# EAGLE schematic gmatrix (EAGLE 9.6.0)
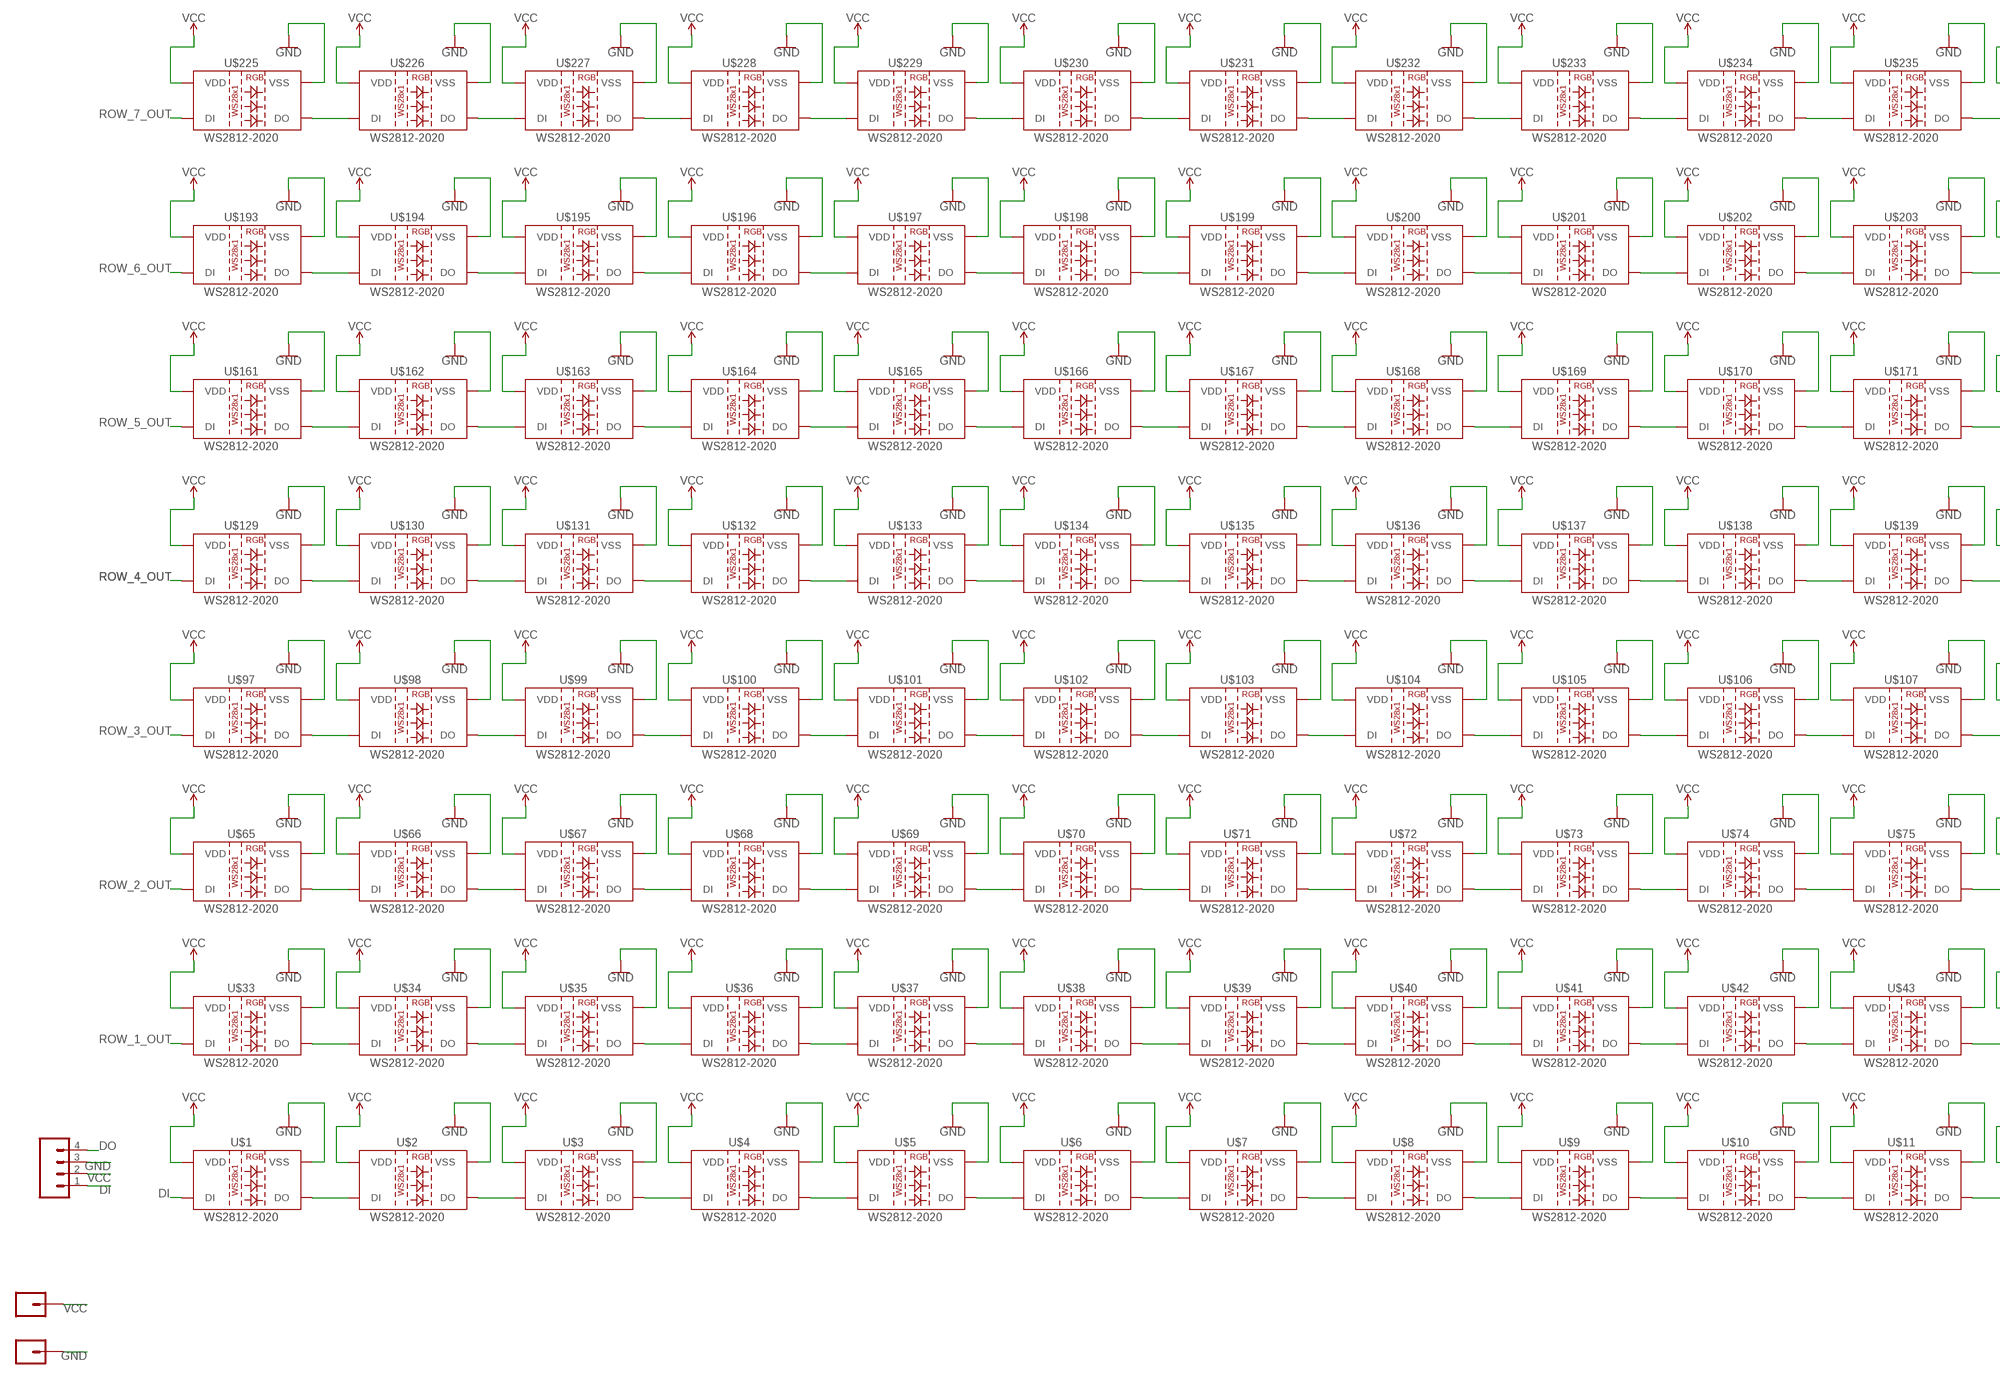
[diagram p0: schematic, sheet 1, part 1 of 3]
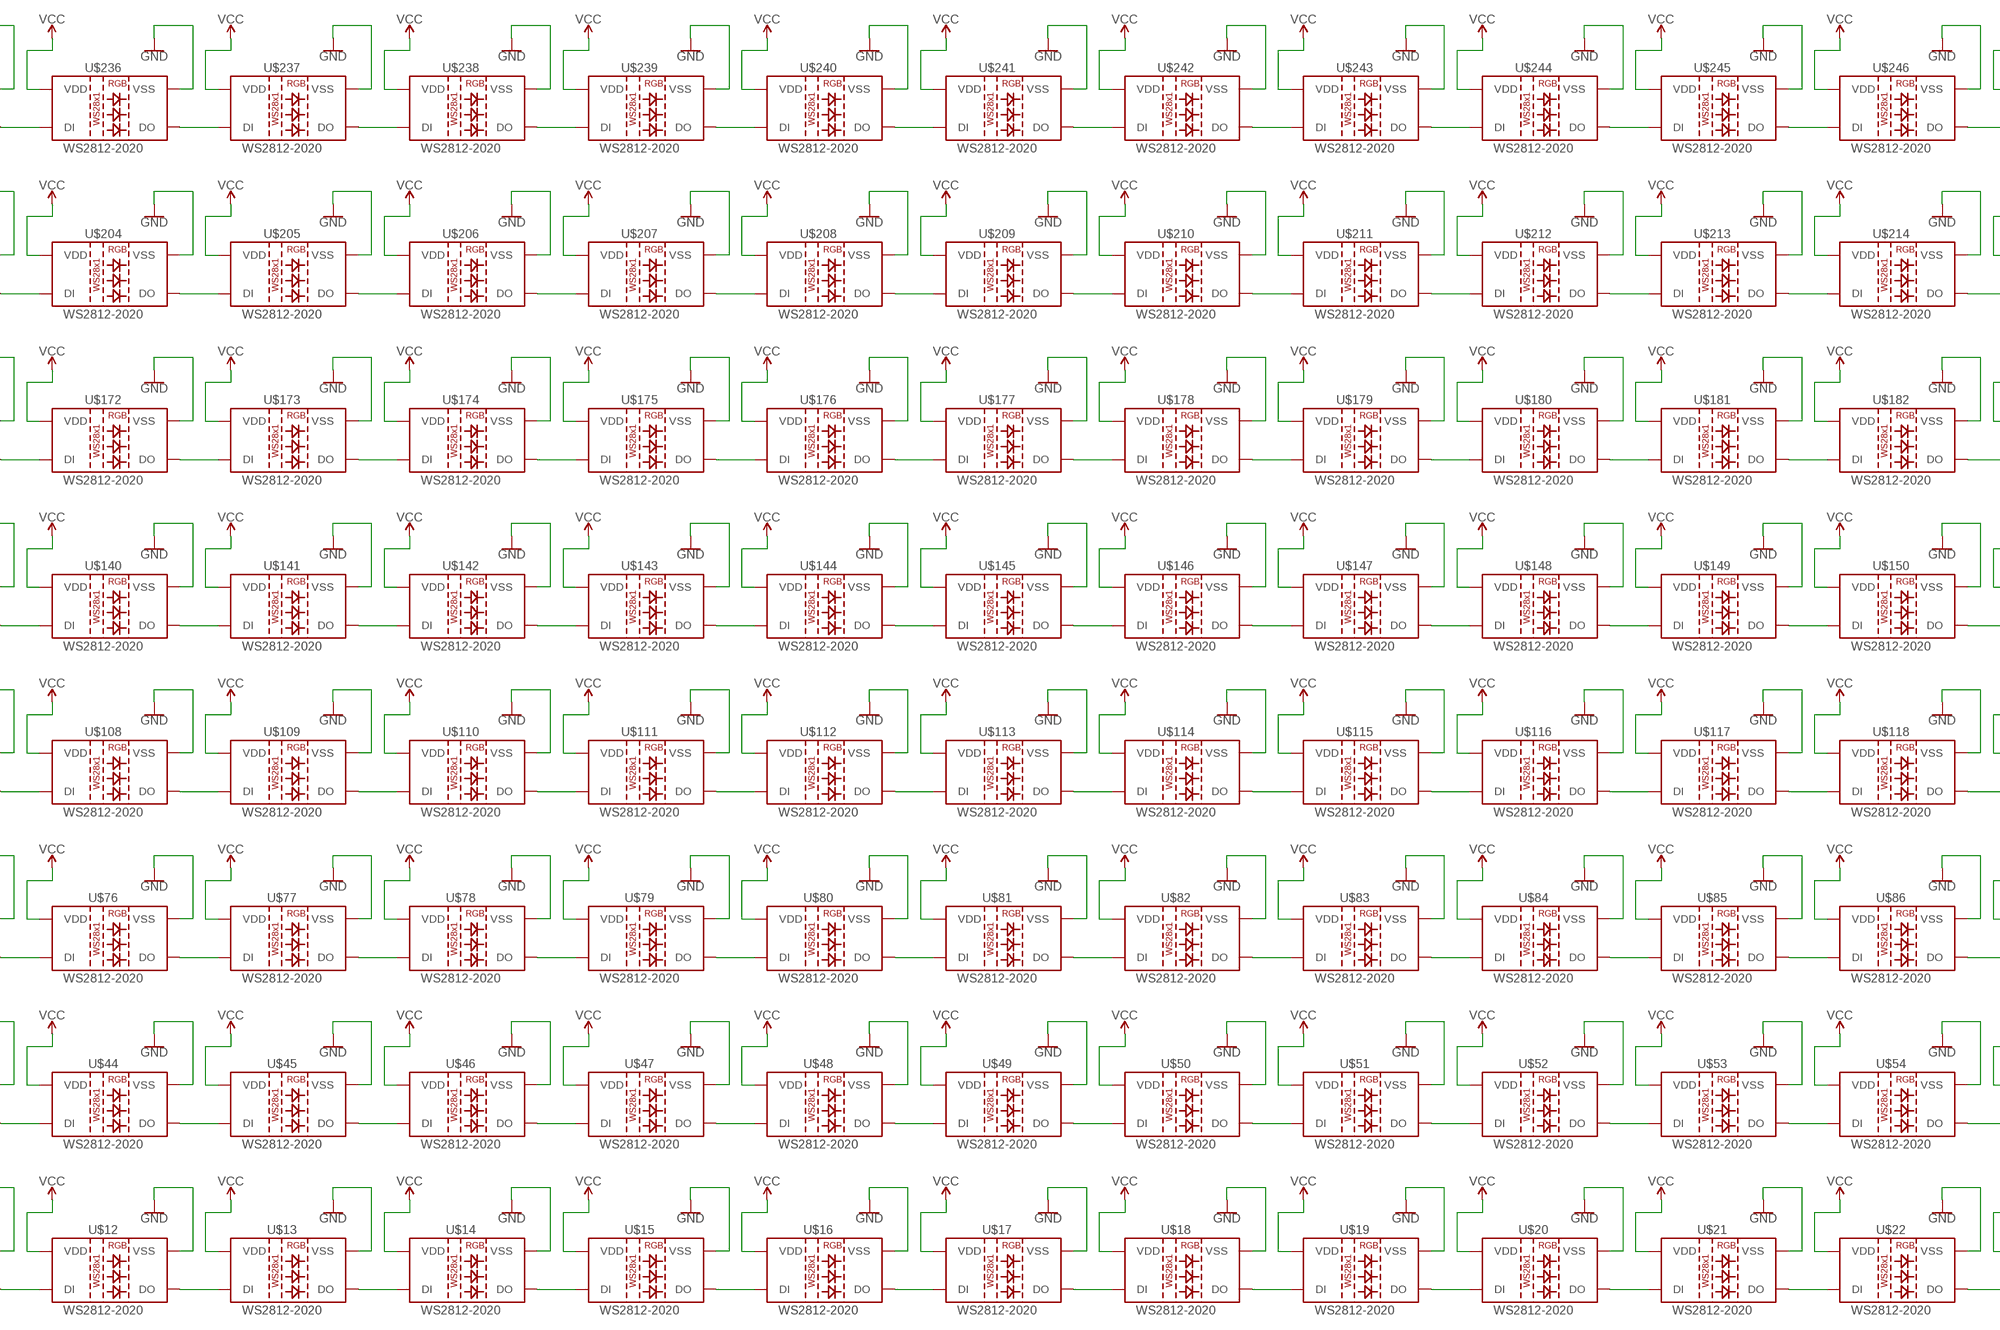
[diagram p1: schematic, sheet 1, part 2 of 3]
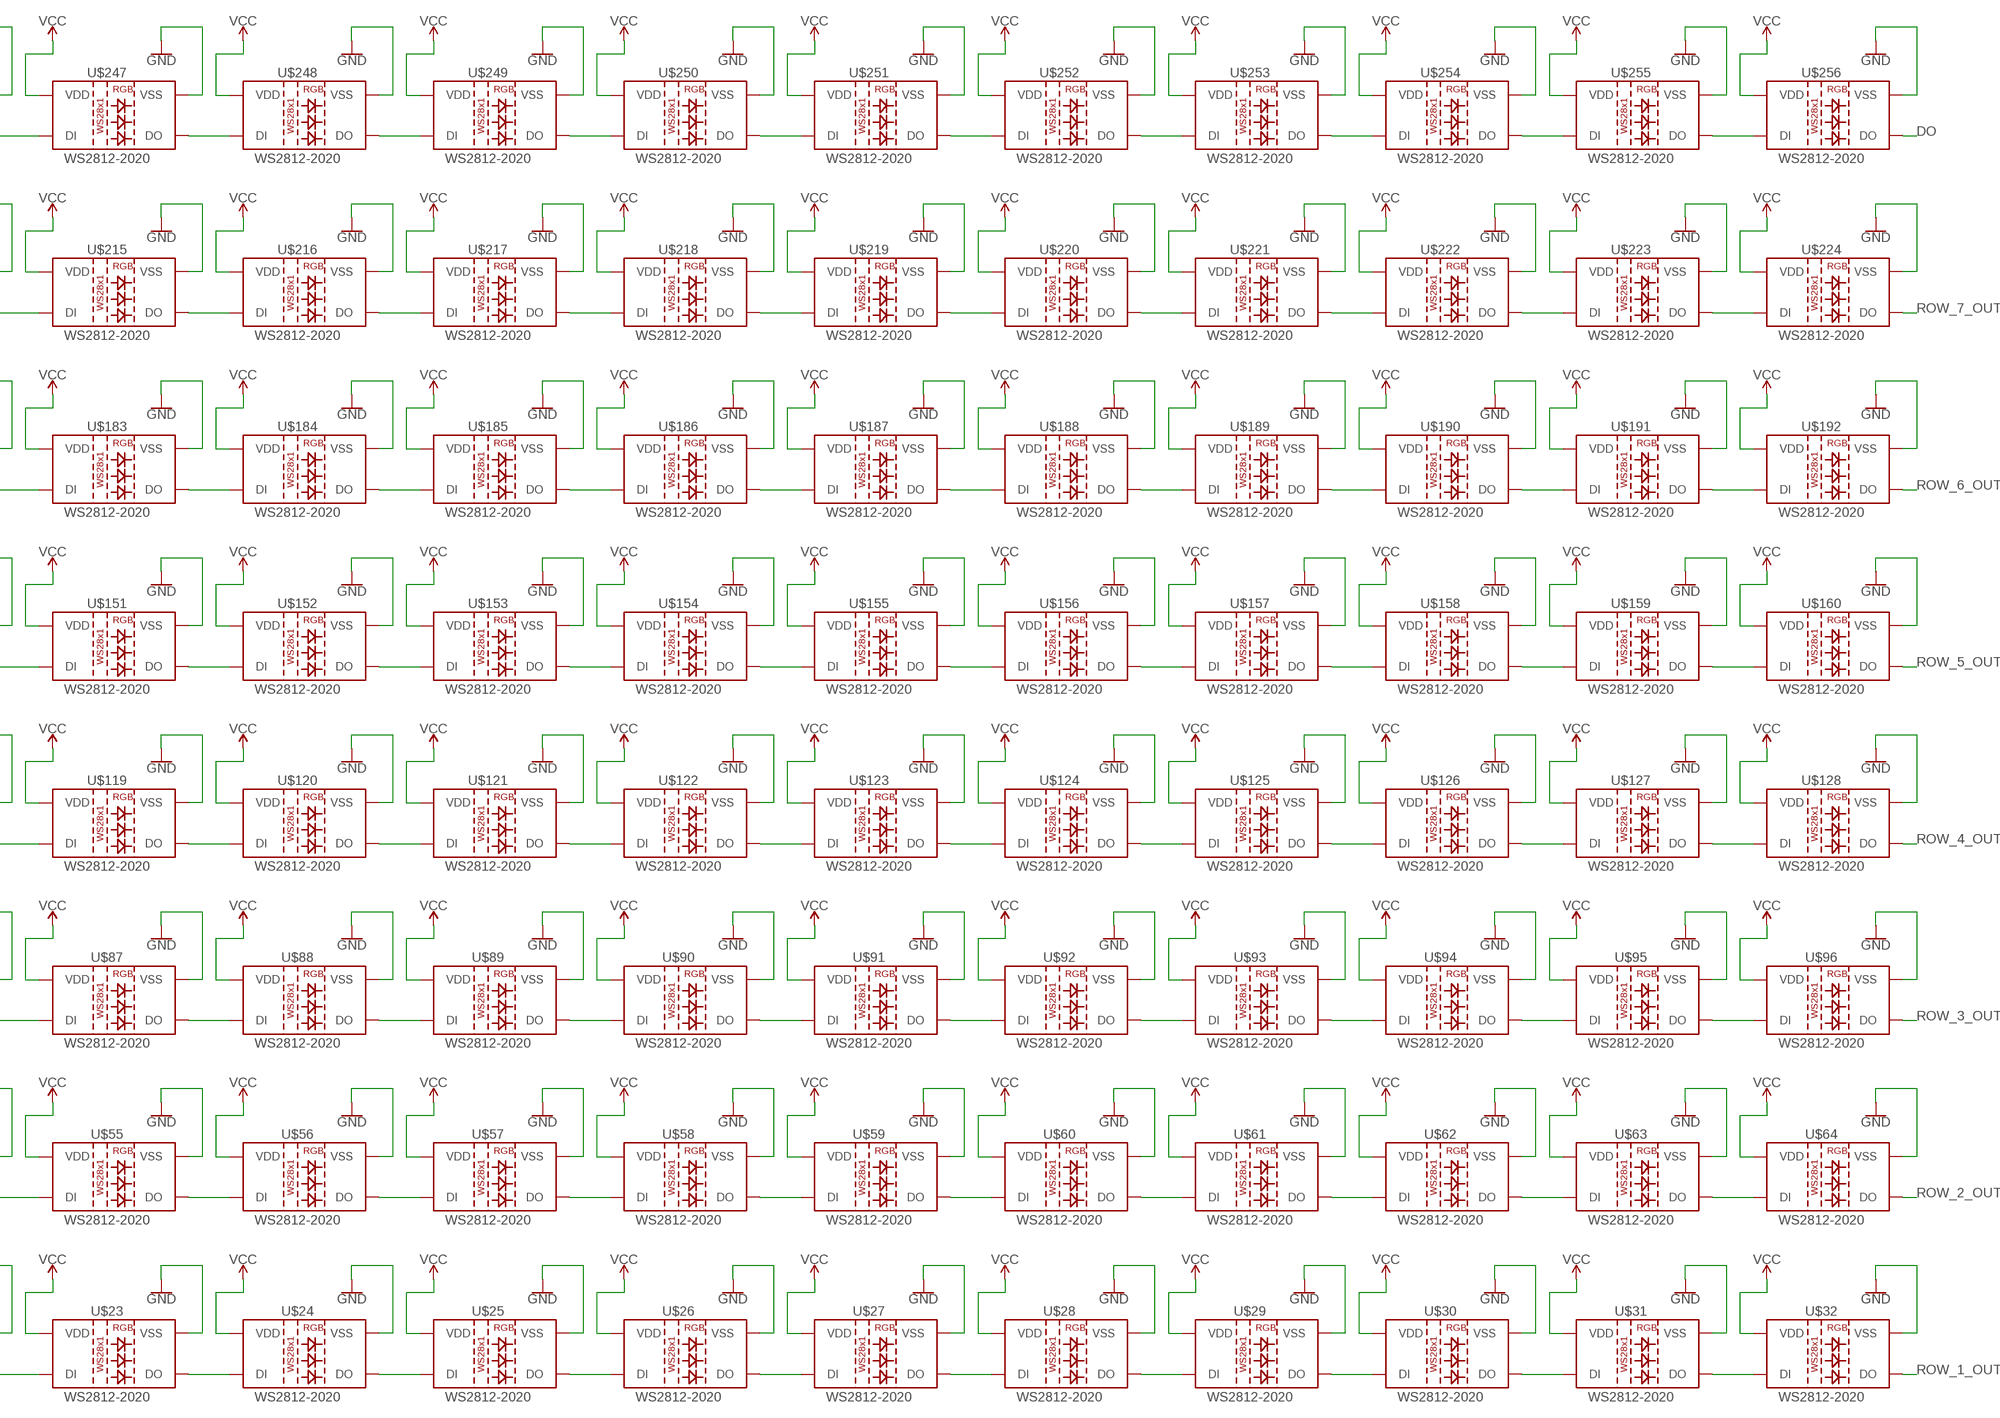
[diagram p2: schematic, sheet 1, part 3 of 3]

## Parts
J1  CONN_041X04_NO_SILK  [1X04_NO_SILK]
J2  CONN_01PTH_NO_SILK_KIT  [1X01NS_KIT]
J3  CONN_01PTH_NO_SILK_KIT  [1X01NS_KIT]
U$1  WS2812-2020  [WS2812-2020]
U$2  WS2812-2020  [WS2812-2020]
U$3  WS2812-2020  [WS2812-2020]
U$4  WS2812-2020  [WS2812-2020]
U$5  WS2812-2020  [WS2812-2020]
U$6  WS2812-2020  [WS2812-2020]
U$7  WS2812-2020  [WS2812-2020]
U$8  WS2812-2020  [WS2812-2020]
U$9  WS2812-2020  [WS2812-2020]
U$10  WS2812-2020  [WS2812-2020]
U$11  WS2812-2020  [WS2812-2020]
U$12  WS2812-2020  [WS2812-2020]
U$13  WS2812-2020  [WS2812-2020]
U$14  WS2812-2020  [WS2812-2020]
U$15  WS2812-2020  [WS2812-2020]
U$16  WS2812-2020  [WS2812-2020]
U$17  WS2812-2020  [WS2812-2020]
U$18  WS2812-2020  [WS2812-2020]
U$19  WS2812-2020  [WS2812-2020]
U$20  WS2812-2020  [WS2812-2020]
U$21  WS2812-2020  [WS2812-2020]
U$22  WS2812-2020  [WS2812-2020]
U$23  WS2812-2020  [WS2812-2020]
U$24  WS2812-2020  [WS2812-2020]
U$25  WS2812-2020  [WS2812-2020]
U$26  WS2812-2020  [WS2812-2020]
U$27  WS2812-2020  [WS2812-2020]
U$28  WS2812-2020  [WS2812-2020]
U$29  WS2812-2020  [WS2812-2020]
U$30  WS2812-2020  [WS2812-2020]
U$31  WS2812-2020  [WS2812-2020]
U$32  WS2812-2020  [WS2812-2020]
U$33  WS2812-2020  [WS2812-2020]
U$34  WS2812-2020  [WS2812-2020]
U$35  WS2812-2020  [WS2812-2020]
U$36  WS2812-2020  [WS2812-2020]
U$37  WS2812-2020  [WS2812-2020]
U$38  WS2812-2020  [WS2812-2020]
U$39  WS2812-2020  [WS2812-2020]
U$40  WS2812-2020  [WS2812-2020]
U$41  WS2812-2020  [WS2812-2020]
U$42  WS2812-2020  [WS2812-2020]
U$43  WS2812-2020  [WS2812-2020]
U$44  WS2812-2020  [WS2812-2020]
U$45  WS2812-2020  [WS2812-2020]
U$46  WS2812-2020  [WS2812-2020]
U$47  WS2812-2020  [WS2812-2020]
U$48  WS2812-2020  [WS2812-2020]
U$49  WS2812-2020  [WS2812-2020]
U$50  WS2812-2020  [WS2812-2020]
U$51  WS2812-2020  [WS2812-2020]
U$52  WS2812-2020  [WS2812-2020]
U$53  WS2812-2020  [WS2812-2020]
U$54  WS2812-2020  [WS2812-2020]
U$55  WS2812-2020  [WS2812-2020]
U$56  WS2812-2020  [WS2812-2020]
U$57  WS2812-2020  [WS2812-2020]
U$58  WS2812-2020  [WS2812-2020]
U$59  WS2812-2020  [WS2812-2020]
U$60  WS2812-2020  [WS2812-2020]
U$61  WS2812-2020  [WS2812-2020]
U$62  WS2812-2020  [WS2812-2020]
U$63  WS2812-2020  [WS2812-2020]
U$64  WS2812-2020  [WS2812-2020]
U$65  WS2812-2020  [WS2812-2020]
U$66  WS2812-2020  [WS2812-2020]
U$67  WS2812-2020  [WS2812-2020]
U$68  WS2812-2020  [WS2812-2020]
U$69  WS2812-2020  [WS2812-2020]
U$70  WS2812-2020  [WS2812-2020]
U$71  WS2812-2020  [WS2812-2020]
U$72  WS2812-2020  [WS2812-2020]
U$73  WS2812-2020  [WS2812-2020]
U$74  WS2812-2020  [WS2812-2020]
U$75  WS2812-2020  [WS2812-2020]
U$76  WS2812-2020  [WS2812-2020]
U$77  WS2812-2020  [WS2812-2020]
U$78  WS2812-2020  [WS2812-2020]
U$79  WS2812-2020  [WS2812-2020]
U$80  WS2812-2020  [WS2812-2020]
U$81  WS2812-2020  [WS2812-2020]
U$82  WS2812-2020  [WS2812-2020]
U$83  WS2812-2020  [WS2812-2020]
U$84  WS2812-2020  [WS2812-2020]
U$85  WS2812-2020  [WS2812-2020]
U$86  WS2812-2020  [WS2812-2020]
U$87  WS2812-2020  [WS2812-2020]
U$88  WS2812-2020  [WS2812-2020]
U$89  WS2812-2020  [WS2812-2020]
U$90  WS2812-2020  [WS2812-2020]
U$91  WS2812-2020  [WS2812-2020]
U$92  WS2812-2020  [WS2812-2020]
U$93  WS2812-2020  [WS2812-2020]
U$94  WS2812-2020  [WS2812-2020]
U$95  WS2812-2020  [WS2812-2020]
U$96  WS2812-2020  [WS2812-2020]
U$97  WS2812-2020  [WS2812-2020]
U$98  WS2812-2020  [WS2812-2020]
U$99  WS2812-2020  [WS2812-2020]
U$100  WS2812-2020  [WS2812-2020]
U$101  WS2812-2020  [WS2812-2020]
U$102  WS2812-2020  [WS2812-2020]
U$103  WS2812-2020  [WS2812-2020]
U$104  WS2812-2020  [WS2812-2020]
U$105  WS2812-2020  [WS2812-2020]
U$106  WS2812-2020  [WS2812-2020]
U$107  WS2812-2020  [WS2812-2020]
U$108  WS2812-2020  [WS2812-2020]
U$109  WS2812-2020  [WS2812-2020]
U$110  WS2812-2020  [WS2812-2020]
U$111  WS2812-2020  [WS2812-2020]
U$112  WS2812-2020  [WS2812-2020]
U$113  WS2812-2020  [WS2812-2020]
U$114  WS2812-2020  [WS2812-2020]
U$115  WS2812-2020  [WS2812-2020]
U$116  WS2812-2020  [WS2812-2020]
U$117  WS2812-2020  [WS2812-2020]
U$118  WS2812-2020  [WS2812-2020]
U$119  WS2812-2020  [WS2812-2020]
U$120  WS2812-2020  [WS2812-2020]
U$121  WS2812-2020  [WS2812-2020]
U$122  WS2812-2020  [WS2812-2020]
U$123  WS2812-2020  [WS2812-2020]
U$124  WS2812-2020  [WS2812-2020]
U$125  WS2812-2020  [WS2812-2020]
U$126  WS2812-2020  [WS2812-2020]
U$127  WS2812-2020  [WS2812-2020]
U$128  WS2812-2020  [WS2812-2020]
U$129  WS2812-2020  [WS2812-2020]
U$130  WS2812-2020  [WS2812-2020]
U$131  WS2812-2020  [WS2812-2020]
U$132  WS2812-2020  [WS2812-2020]
U$133  WS2812-2020  [WS2812-2020]
U$134  WS2812-2020  [WS2812-2020]
U$135  WS2812-2020  [WS2812-2020]
U$136  WS2812-2020  [WS2812-2020]
U$137  WS2812-2020  [WS2812-2020]
U$138  WS2812-2020  [WS2812-2020]
U$139  WS2812-2020  [WS2812-2020]
U$140  WS2812-2020  [WS2812-2020]
U$141  WS2812-2020  [WS2812-2020]
U$142  WS2812-2020  [WS2812-2020]
U$143  WS2812-2020  [WS2812-2020]
U$144  WS2812-2020  [WS2812-2020]
U$145  WS2812-2020  [WS2812-2020]
U$146  WS2812-2020  [WS2812-2020]
U$147  WS2812-2020  [WS2812-2020]
U$148  WS2812-2020  [WS2812-2020]
U$149  WS2812-2020  [WS2812-2020]
U$150  WS2812-2020  [WS2812-2020]
U$151  WS2812-2020  [WS2812-2020]
U$152  WS2812-2020  [WS2812-2020]
U$153  WS2812-2020  [WS2812-2020]
U$154  WS2812-2020  [WS2812-2020]
U$155  WS2812-2020  [WS2812-2020]
U$156  WS2812-2020  [WS2812-2020]
U$157  WS2812-2020  [WS2812-2020]
U$158  WS2812-2020  [WS2812-2020]
U$159  WS2812-2020  [WS2812-2020]
U$160  WS2812-2020  [WS2812-2020]
U$161  WS2812-2020  [WS2812-2020]
U$162  WS2812-2020  [WS2812-2020]
U$163  WS2812-2020  [WS2812-2020]
U$164  WS2812-2020  [WS2812-2020]
U$165  WS2812-2020  [WS2812-2020]
U$166  WS2812-2020  [WS2812-2020]
U$167  WS2812-2020  [WS2812-2020]
U$168  WS2812-2020  [WS2812-2020]
U$169  WS2812-2020  [WS2812-2020]
U$170  WS2812-2020  [WS2812-2020]
U$171  WS2812-2020  [WS2812-2020]
U$172  WS2812-2020  [WS2812-2020]
U$173  WS2812-2020  [WS2812-2020]
U$174  WS2812-2020  [WS2812-2020]
U$175  WS2812-2020  [WS2812-2020]
U$176  WS2812-2020  [WS2812-2020]
U$177  WS2812-2020  [WS2812-2020]
U$178  WS2812-2020  [WS2812-2020]
U$179  WS2812-2020  [WS2812-2020]
U$180  WS2812-2020  [WS2812-2020]
U$181  WS2812-2020  [WS2812-2020]
U$182  WS2812-2020  [WS2812-2020]
U$183  WS2812-2020  [WS2812-2020]
U$184  WS2812-2020  [WS2812-2020]
U$185  WS2812-2020  [WS2812-2020]
U$186  WS2812-2020  [WS2812-2020]
U$187  WS2812-2020  [WS2812-2020]
U$188  WS2812-2020  [WS2812-2020]
U$189  WS2812-2020  [WS2812-2020]
U$190  WS2812-2020  [WS2812-2020]
U$191  WS2812-2020  [WS2812-2020]
U$192  WS2812-2020  [WS2812-2020]
U$193  WS2812-2020  [WS2812-2020]
U$194  WS2812-2020  [WS2812-2020]
U$195  WS2812-2020  [WS2812-2020]
U$196  WS2812-2020  [WS2812-2020]
U$197  WS2812-2020  [WS2812-2020]
U$198  WS2812-2020  [WS2812-2020]
U$199  WS2812-2020  [WS2812-2020]
U$200  WS2812-2020  [WS2812-2020]
U$201  WS2812-2020  [WS2812-2020]
U$202  WS2812-2020  [WS2812-2020]
U$203  WS2812-2020  [WS2812-2020]
U$204  WS2812-2020  [WS2812-2020]
U$205  WS2812-2020  [WS2812-2020]
U$206  WS2812-2020  [WS2812-2020]
U$207  WS2812-2020  [WS2812-2020]
U$208  WS2812-2020  [WS2812-2020]
U$209  WS2812-2020  [WS2812-2020]
U$210  WS2812-2020  [WS2812-2020]
U$211  WS2812-2020  [WS2812-2020]
U$212  WS2812-2020  [WS2812-2020]
U$213  WS2812-2020  [WS2812-2020]
U$214  WS2812-2020  [WS2812-2020]
U$215  WS2812-2020  [WS2812-2020]
U$216  WS2812-2020  [WS2812-2020]
U$217  WS2812-2020  [WS2812-2020]
U$218  WS2812-2020  [WS2812-2020]
U$219  WS2812-2020  [WS2812-2020]
U$220  WS2812-2020  [WS2812-2020]
U$221  WS2812-2020  [WS2812-2020]
U$222  WS2812-2020  [WS2812-2020]
U$223  WS2812-2020  [WS2812-2020]
U$224  WS2812-2020  [WS2812-2020]
U$225  WS2812-2020  [WS2812-2020]
U$226  WS2812-2020  [WS2812-2020]
U$227  WS2812-2020  [WS2812-2020]
U$228  WS2812-2020  [WS2812-2020]
U$229  WS2812-2020  [WS2812-2020]
U$230  WS2812-2020  [WS2812-2020]
U$231  WS2812-2020  [WS2812-2020]
U$232  WS2812-2020  [WS2812-2020]
U$233  WS2812-2020  [WS2812-2020]
U$234  WS2812-2020  [WS2812-2020]
U$235  WS2812-2020  [WS2812-2020]
U$236  WS2812-2020  [WS2812-2020]
U$237  WS2812-2020  [WS2812-2020]
U$238  WS2812-2020  [WS2812-2020]
U$239  WS2812-2020  [WS2812-2020]
U$240  WS2812-2020  [WS2812-2020]
U$241  WS2812-2020  [WS2812-2020]
U$242  WS2812-2020  [WS2812-2020]
U$243  WS2812-2020  [WS2812-2020]
U$244  WS2812-2020  [WS2812-2020]
U$245  WS2812-2020  [WS2812-2020]
U$246  WS2812-2020  [WS2812-2020]
U$247  WS2812-2020  [WS2812-2020]
U$248  WS2812-2020  [WS2812-2020]
U$249  WS2812-2020  [WS2812-2020]
U$250  WS2812-2020  [WS2812-2020]
U$251  WS2812-2020  [WS2812-2020]
U$252  WS2812-2020  [WS2812-2020]
U$253  WS2812-2020  [WS2812-2020]
U$254  WS2812-2020  [WS2812-2020]
U$255  WS2812-2020  [WS2812-2020]
U$256  WS2812-2020  [WS2812-2020]

## Nets
DI: J1.1 U$1.3(DI)
DO: J1.4 U$256.1(DO)
GND: J1.3 J3.1 U$1.2(VSS) U$2.2(VSS) U$3.2(VSS) U$4.2(VSS) U$5.2(VSS) U$6.2(VSS) U$7.2(VSS) U$8.2(VSS) U$9.2(VSS) U$10.2(VSS) U$11.2(VSS) U$12.2(VSS) U$13.2(VSS) U$14.2(VSS) U$15.2(VSS) U$16.2(VSS) U$17.2(VSS) U$18.2(VSS) U$19.2(VSS) U$20.2(VSS) U$21.2(VSS) U$22.2(VSS) U$23.2(VSS) U$24.2(VSS) U$25.2(VSS) U$26.2(VSS) U$27.2(VSS) U$28.2(VSS) U$29.2(VSS) U$30.2(VSS) U$31.2(VSS) U$32.2(VSS) U$33.2(VSS) U$34.2(VSS) U$35.2(VSS) U$36.2(VSS) U$37.2(VSS) U$38.2(VSS) U$39.2(VSS) U$40.2(VSS) U$41.2(VSS) U$42.2(VSS) U$43.2(VSS) U$44.2(VSS) U$45.2(VSS) U$46.2(VSS) U$47.2(VSS) U$48.2(VSS) U$49.2(VSS) U$50.2(VSS) U$51.2(VSS) U$52.2(VSS) U$53.2(VSS) U$54.2(VSS) U$55.2(VSS) U$56.2(VSS) U$57.2(VSS) U$58.2(VSS) U$59.2(VSS) U$60.2(VSS) U$61.2(VSS) U$62.2(VSS) U$63.2(VSS) U$64.2(VSS) U$65.2(VSS) U$66.2(VSS) U$67.2(VSS) U$68.2(VSS) U$69.2(VSS) U$70.2(VSS) U$71.2(VSS) U$72.2(VSS) U$73.2(VSS) U$74.2(VSS) U$75.2(VSS) U$76.2(VSS) U$77.2(VSS) U$78.2(VSS) U$79.2(VSS) U$80.2(VSS) U$81.2(VSS) U$82.2(VSS) U$83.2(VSS) U$84.2(VSS) U$85.2(VSS) U$86.2(VSS) U$87.2(VSS) U$88.2(VSS) U$89.2(VSS) U$90.2(VSS) U$91.2(VSS) U$92.2(VSS) U$93.2(VSS) U$94.2(VSS) U$95.2(VSS) U$96.2(VSS) U$97.2(VSS) U$98.2(VSS) U$99.2(VSS) U$100.2(VSS) U$101.2(VSS) U$102.2(VSS) U$103.2(VSS) U$104.2(VSS) U$105.2(VSS) U$106.2(VSS) U$107.2(VSS) U$108.2(VSS) U$109.2(VSS) U$110.2(VSS) U$111.2(VSS) U$112.2(VSS) U$113.2(VSS) U$114.2(VSS) U$115.2(VSS) U$116.2(VSS) U$117.2(VSS) U$118.2(VSS) U$119.2(VSS) U$120.2(VSS) U$121.2(VSS) U$122.2(VSS) U$123.2(VSS) U$124.2(VSS) U$125.2(VSS) U$126.2(VSS) U$127.2(VSS) U$128.2(VSS) U$129.2(VSS) U$130.2(VSS) U$131.2(VSS) U$132.2(VSS) U$133.2(VSS) U$134.2(VSS) U$135.2(VSS) U$136.2(VSS) U$137.2(VSS) U$138.2(VSS) U$139.2(VSS) U$140.2(VSS) U$141.2(VSS) U$142.2(VSS) U$143.2(VSS) U$144.2(VSS) U$145.2(VSS) U$146.2(VSS) U$147.2(VSS) U$148.2(VSS) U$149.2(VSS) U$150.2(VSS) U$151.2(VSS) U$152.2(VSS) U$153.2(VSS) U$154.2(VSS) U$155.2(VSS) U$156.2(VSS) U$157.2(VSS) U$158.2(VSS) U$159.2(VSS) U$160.2(VSS) U$161.2(VSS) U$162.2(VSS) U$163.2(VSS) U$164.2(VSS) U$165.2(VSS) U$166.2(VSS) U$167.2(VSS) U$168.2(VSS) U$169.2(VSS) U$170.2(VSS) U$171.2(VSS) U$172.2(VSS) U$173.2(VSS) U$174.2(VSS) U$175.2(VSS) U$176.2(VSS) U$177.2(VSS) U$178.2(VSS) U$179.2(VSS) U$180.2(VSS) U$181.2(VSS) U$182.2(VSS) U$183.2(VSS) U$184.2(VSS) U$185.2(VSS) U$186.2(VSS) U$187.2(VSS) U$188.2(VSS) U$189.2(VSS) U$190.2(VSS) U$191.2(VSS) U$192.2(VSS) U$193.2(VSS) U$194.2(VSS) U$195.2(VSS) U$196.2(VSS) U$197.2(VSS) U$198.2(VSS) U$199.2(VSS) U$200.2(VSS) U$201.2(VSS) U$202.2(VSS) U$203.2(VSS) U$204.2(VSS) U$205.2(VSS) U$206.2(VSS) U$207.2(VSS) U$208.2(VSS) U$209.2(VSS) U$210.2(VSS) U$211.2(VSS) U$212.2(VSS) U$213.2(VSS) U$214.2(VSS) U$215.2(VSS) U$216.2(VSS) U$217.2(VSS) U$218.2(VSS) U$219.2(VSS) U$220.2(VSS) U$221.2(VSS) U$222.2(VSS) U$223.2(VSS) U$224.2(VSS) U$225.2(VSS) U$226.2(VSS) U$227.2(VSS) U$228.2(VSS) U$229.2(VSS) U$230.2(VSS) U$231.2(VSS) U$232.2(VSS) U$233.2(VSS) U$234.2(VSS) U$235.2(VSS) U$236.2(VSS) U$237.2(VSS) U$238.2(VSS) U$239.2(VSS) U$240.2(VSS) U$241.2(VSS) U$242.2(VSS) U$243.2(VSS) U$244.2(VSS) U$245.2(VSS) U$246.2(VSS) U$247.2(VSS) U$248.2(VSS) U$249.2(VSS) U$250.2(VSS) U$251.2(VSS) U$252.2(VSS) U$253.2(VSS) U$254.2(VSS) U$255.2(VSS) U$256.2(VSS)
N$1: U$1.1(DO) U$2.3(DI)
N$2: U$2.1(DO) U$3.3(DI)
N$3: U$3.1(DO) U$4.3(DI)
N$4: U$4.1(DO) U$5.3(DI)
N$5: U$5.1(DO) U$6.3(DI)
N$6: U$6.1(DO) U$7.3(DI)
N$7: U$7.1(DO) U$8.3(DI)
N$8: U$8.1(DO) U$9.3(DI)
N$9: U$9.1(DO) U$10.3(DI)
N$10: U$10.1(DO) U$11.3(DI)
N$11: U$11.1(DO) U$12.3(DI)
N$12: U$12.1(DO) U$13.3(DI)
N$13: U$13.1(DO) U$14.3(DI)
N$14: U$14.1(DO) U$15.3(DI)
N$15: U$15.1(DO) U$16.3(DI)
N$16: U$16.1(DO) U$17.3(DI)
N$17: U$17.1(DO) U$18.3(DI)
N$18: U$18.1(DO) U$19.3(DI)
N$19: U$19.1(DO) U$20.3(DI)
N$20: U$20.1(DO) U$21.3(DI)
N$21: U$21.1(DO) U$22.3(DI)
N$22: U$22.1(DO) U$23.3(DI)
N$23: U$23.1(DO) U$24.3(DI)
N$24: U$24.1(DO) U$25.3(DI)
N$25: U$25.1(DO) U$26.3(DI)
N$26: U$26.1(DO) U$27.3(DI)
N$27: U$27.1(DO) U$28.3(DI)
N$28: U$28.1(DO) U$29.3(DI)
N$29: U$29.1(DO) U$30.3(DI)
N$30: U$30.1(DO) U$31.3(DI)
N$31: U$31.1(DO) U$32.3(DI)
N$32: U$33.1(DO) U$34.3(DI)
N$33: U$34.1(DO) U$35.3(DI)
N$34: U$35.1(DO) U$36.3(DI)
N$35: U$36.1(DO) U$37.3(DI)
N$36: U$37.1(DO) U$38.3(DI)
N$37: U$38.1(DO) U$39.3(DI)
N$38: U$39.1(DO) U$40.3(DI)
N$39: U$40.1(DO) U$41.3(DI)
N$40: U$41.1(DO) U$42.3(DI)
N$41: U$42.1(DO) U$43.3(DI)
N$42: U$43.1(DO) U$44.3(DI)
N$43: U$44.1(DO) U$45.3(DI)
N$44: U$45.1(DO) U$46.3(DI)
N$45: U$46.1(DO) U$47.3(DI)
N$46: U$47.1(DO) U$48.3(DI)
N$47: U$48.1(DO) U$49.3(DI)
N$48: U$49.1(DO) U$50.3(DI)
N$49: U$50.1(DO) U$51.3(DI)
N$50: U$51.1(DO) U$52.3(DI)
N$51: U$52.1(DO) U$53.3(DI)
N$52: U$53.1(DO) U$54.3(DI)
N$53: U$54.1(DO) U$55.3(DI)
N$54: U$55.1(DO) U$56.3(DI)
N$55: U$56.1(DO) U$57.3(DI)
N$56: U$57.1(DO) U$58.3(DI)
N$57: U$58.1(DO) U$59.3(DI)
N$58: U$59.1(DO) U$60.3(DI)
N$59: U$60.1(DO) U$61.3(DI)
N$60: U$61.1(DO) U$62.3(DI)
N$61: U$62.1(DO) U$63.3(DI)
N$62: U$63.1(DO) U$64.3(DI)
N$63: U$65.1(DO) U$66.3(DI)
N$64: U$66.1(DO) U$67.3(DI)
N$65: U$67.1(DO) U$68.3(DI)
N$66: U$68.1(DO) U$69.3(DI)
N$67: U$69.1(DO) U$70.3(DI)
N$68: U$70.1(DO) U$71.3(DI)
N$69: U$71.1(DO) U$72.3(DI)
N$70: U$72.1(DO) U$73.3(DI)
N$71: U$73.1(DO) U$74.3(DI)
N$72: U$74.1(DO) U$75.3(DI)
N$73: U$75.1(DO) U$76.3(DI)
N$74: U$76.1(DO) U$77.3(DI)
N$75: U$77.1(DO) U$78.3(DI)
N$76: U$78.1(DO) U$79.3(DI)
N$77: U$79.1(DO) U$80.3(DI)
N$78: U$80.1(DO) U$81.3(DI)
N$79: U$81.1(DO) U$82.3(DI)
N$80: U$82.1(DO) U$83.3(DI)
N$81: U$83.1(DO) U$84.3(DI)
N$82: U$84.1(DO) U$85.3(DI)
N$83: U$85.1(DO) U$86.3(DI)
N$84: U$86.1(DO) U$87.3(DI)
N$85: U$87.1(DO) U$88.3(DI)
N$86: U$88.1(DO) U$89.3(DI)
N$87: U$89.1(DO) U$90.3(DI)
N$88: U$90.1(DO) U$91.3(DI)
N$89: U$91.1(DO) U$92.3(DI)
N$90: U$92.1(DO) U$93.3(DI)
N$91: U$93.1(DO) U$94.3(DI)
N$92: U$94.1(DO) U$95.3(DI)
N$93: U$95.1(DO) U$96.3(DI)
N$94: U$97.1(DO) U$98.3(DI)
N$95: U$98.1(DO) U$99.3(DI)
N$96: U$99.1(DO) U$100.3(DI)
N$97: U$100.1(DO) U$101.3(DI)
N$98: U$101.1(DO) U$102.3(DI)
N$99: U$102.1(DO) U$103.3(DI)
N$100: U$103.1(DO) U$104.3(DI)
N$101: U$104.1(DO) U$105.3(DI)
N$102: U$105.1(DO) U$106.3(DI)
N$103: U$106.1(DO) U$107.3(DI)
N$104: U$107.1(DO) U$108.3(DI)
N$105: U$108.1(DO) U$109.3(DI)
N$106: U$109.1(DO) U$110.3(DI)
N$107: U$110.1(DO) U$111.3(DI)
N$108: U$111.1(DO) U$112.3(DI)
N$109: U$112.1(DO) U$113.3(DI)
N$110: U$113.1(DO) U$114.3(DI)
N$111: U$114.1(DO) U$115.3(DI)
N$112: U$115.1(DO) U$116.3(DI)
N$113: U$116.1(DO) U$117.3(DI)
N$114: U$117.1(DO) U$118.3(DI)
N$115: U$118.1(DO) U$119.3(DI)
N$116: U$119.1(DO) U$120.3(DI)
N$117: U$120.1(DO) U$121.3(DI)
N$118: U$121.1(DO) U$122.3(DI)
N$119: U$122.1(DO) U$123.3(DI)
N$120: U$123.1(DO) U$124.3(DI)
N$121: U$124.1(DO) U$125.3(DI)
N$122: U$125.1(DO) U$126.3(DI)
N$123: U$126.1(DO) U$127.3(DI)
N$124: U$127.1(DO) U$128.3(DI)
N$125: U$129.1(DO) U$130.3(DI)
N$126: U$130.1(DO) U$131.3(DI)
N$127: U$131.1(DO) U$132.3(DI)
N$128: U$132.1(DO) U$133.3(DI)
N$129: U$133.1(DO) U$134.3(DI)
N$130: U$134.1(DO) U$135.3(DI)
N$131: U$135.1(DO) U$136.3(DI)
N$132: U$136.1(DO) U$137.3(DI)
N$133: U$137.1(DO) U$138.3(DI)
N$134: U$138.1(DO) U$139.3(DI)
N$135: U$139.1(DO) U$140.3(DI)
N$136: U$140.1(DO) U$141.3(DI)
N$137: U$141.1(DO) U$142.3(DI)
N$138: U$142.1(DO) U$143.3(DI)
N$139: U$143.1(DO) U$144.3(DI)
N$140: U$144.1(DO) U$145.3(DI)
N$141: U$145.1(DO) U$146.3(DI)
N$142: U$146.1(DO) U$147.3(DI)
N$143: U$147.1(DO) U$148.3(DI)
N$144: U$148.1(DO) U$149.3(DI)
N$145: U$149.1(DO) U$150.3(DI)
N$146: U$150.1(DO) U$151.3(DI)
N$147: U$151.1(DO) U$152.3(DI)
N$148: U$152.1(DO) U$153.3(DI)
N$149: U$153.1(DO) U$154.3(DI)
N$150: U$154.1(DO) U$155.3(DI)
N$151: U$155.1(DO) U$156.3(DI)
N$152: U$156.1(DO) U$157.3(DI)
N$153: U$157.1(DO) U$158.3(DI)
N$154: U$158.1(DO) U$159.3(DI)
N$155: U$159.1(DO) U$160.3(DI)
N$156: U$161.1(DO) U$162.3(DI)
N$157: U$162.1(DO) U$163.3(DI)
N$158: U$163.1(DO) U$164.3(DI)
N$159: U$164.1(DO) U$165.3(DI)
N$160: U$165.1(DO) U$166.3(DI)
N$161: U$166.1(DO) U$167.3(DI)
N$162: U$167.1(DO) U$168.3(DI)
N$163: U$168.1(DO) U$169.3(DI)
N$164: U$169.1(DO) U$170.3(DI)
N$165: U$170.1(DO) U$171.3(DI)
N$166: U$171.1(DO) U$172.3(DI)
N$167: U$172.1(DO) U$173.3(DI)
N$168: U$173.1(DO) U$174.3(DI)
N$169: U$174.1(DO) U$175.3(DI)
N$170: U$175.1(DO) U$176.3(DI)
N$171: U$176.1(DO) U$177.3(DI)
N$172: U$177.1(DO) U$178.3(DI)
N$173: U$178.1(DO) U$179.3(DI)
N$174: U$179.1(DO) U$180.3(DI)
N$175: U$180.1(DO) U$181.3(DI)
N$176: U$181.1(DO) U$182.3(DI)
N$177: U$182.1(DO) U$183.3(DI)
N$178: U$183.1(DO) U$184.3(DI)
N$179: U$184.1(DO) U$185.3(DI)
N$180: U$185.1(DO) U$186.3(DI)
N$181: U$186.1(DO) U$187.3(DI)
N$182: U$187.1(DO) U$188.3(DI)
N$183: U$188.1(DO) U$189.3(DI)
N$184: U$189.1(DO) U$190.3(DI)
N$185: U$190.1(DO) U$191.3(DI)
N$186: U$191.1(DO) U$192.3(DI)
N$187: U$193.1(DO) U$194.3(DI)
N$188: U$194.1(DO) U$195.3(DI)
N$189: U$195.1(DO) U$196.3(DI)
N$190: U$196.1(DO) U$197.3(DI)
N$191: U$197.1(DO) U$198.3(DI)
N$192: U$198.1(DO) U$199.3(DI)
N$193: U$199.1(DO) U$200.3(DI)
N$194: U$200.1(DO) U$201.3(DI)
N$195: U$201.1(DO) U$202.3(DI)
N$196: U$202.1(DO) U$203.3(DI)
N$197: U$203.1(DO) U$204.3(DI)
N$198: U$204.1(DO) U$205.3(DI)
N$199: U$205.1(DO) U$206.3(DI)
N$200: U$206.1(DO) U$207.3(DI)
N$201: U$207.1(DO) U$208.3(DI)
N$202: U$208.1(DO) U$209.3(DI)
N$203: U$209.1(DO) U$210.3(DI)
N$204: U$210.1(DO) U$211.3(DI)
N$205: U$211.1(DO) U$212.3(DI)
N$206: U$212.1(DO) U$213.3(DI)
N$207: U$213.1(DO) U$214.3(DI)
N$208: U$214.1(DO) U$215.3(DI)
N$209: U$215.1(DO) U$216.3(DI)
N$210: U$216.1(DO) U$217.3(DI)
N$211: U$217.1(DO) U$218.3(DI)
N$212: U$218.1(DO) U$219.3(DI)
N$213: U$219.1(DO) U$220.3(DI)
N$214: U$220.1(DO) U$221.3(DI)
N$215: U$221.1(DO) U$222.3(DI)
N$216: U$222.1(DO) U$223.3(DI)
N$217: U$223.1(DO) U$224.3(DI)
N$218: U$225.1(DO) U$226.3(DI)
N$219: U$226.1(DO) U$227.3(DI)
N$220: U$227.1(DO) U$228.3(DI)
N$221: U$228.1(DO) U$229.3(DI)
N$222: U$229.1(DO) U$230.3(DI)
N$223: U$230.1(DO) U$231.3(DI)
N$224: U$231.1(DO) U$232.3(DI)
N$225: U$232.1(DO) U$233.3(DI)
N$226: U$233.1(DO) U$234.3(DI)
N$227: U$234.1(DO) U$235.3(DI)
N$228: U$235.1(DO) U$236.3(DI)
N$229: U$236.1(DO) U$237.3(DI)
N$230: U$237.1(DO) U$238.3(DI)
N$231: U$238.1(DO) U$239.3(DI)
N$232: U$239.1(DO) U$240.3(DI)
N$233: U$240.1(DO) U$241.3(DI)
N$234: U$241.1(DO) U$242.3(DI)
N$235: U$242.1(DO) U$243.3(DI)
N$236: U$243.1(DO) U$244.3(DI)
N$237: U$244.1(DO) U$245.3(DI)
N$238: U$245.1(DO) U$246.3(DI)
N$239: U$246.1(DO) U$247.3(DI)
N$240: U$247.1(DO) U$248.3(DI)
N$241: U$248.1(DO) U$249.3(DI)
N$242: U$249.1(DO) U$250.3(DI)
N$243: U$250.1(DO) U$251.3(DI)
N$244: U$251.1(DO) U$252.3(DI)
N$245: U$252.1(DO) U$253.3(DI)
N$246: U$253.1(DO) U$254.3(DI)
N$247: U$254.1(DO) U$255.3(DI)
N$248: U$255.1(DO) U$256.3(DI)
ROW_1_OUT: U$32.1(DO) U$33.3(DI)
ROW_2_OUT: U$64.1(DO) U$65.3(DI)
ROW_3_OUT: U$96.1(DO) U$97.3(DI)
ROW_4_OUT: U$128.1(DO) U$129.3(DI)
ROW_5_OUT: U$160.1(DO) U$161.3(DI)
ROW_6_OUT: U$192.1(DO) U$193.3(DI)
ROW_7_OUT: U$224.1(DO) U$225.3(DI)
VCC: J1.2 J2.1 U$1.4(VDD) U$2.4(VDD) U$3.4(VDD) U$4.4(VDD) U$5.4(VDD) U$6.4(VDD) U$7.4(VDD) U$8.4(VDD) U$9.4(VDD) U$10.4(VDD) U$11.4(VDD) U$12.4(VDD) U$13.4(VDD) U$14.4(VDD) U$15.4(VDD) U$16.4(VDD) U$17.4(VDD) U$18.4(VDD) U$19.4(VDD) U$20.4(VDD) U$21.4(VDD) U$22.4(VDD) U$23.4(VDD) U$24.4(VDD) U$25.4(VDD) U$26.4(VDD) U$27.4(VDD) U$28.4(VDD) U$29.4(VDD) U$30.4(VDD) U$31.4(VDD) U$32.4(VDD) U$33.4(VDD) U$34.4(VDD) U$35.4(VDD) U$36.4(VDD) U$37.4(VDD) U$38.4(VDD) U$39.4(VDD) U$40.4(VDD) U$41.4(VDD) U$42.4(VDD) U$43.4(VDD) U$44.4(VDD) U$45.4(VDD) U$46.4(VDD) U$47.4(VDD) U$48.4(VDD) U$49.4(VDD) U$50.4(VDD) U$51.4(VDD) U$52.4(VDD) U$53.4(VDD) U$54.4(VDD) U$55.4(VDD) U$56.4(VDD) U$57.4(VDD) U$58.4(VDD) U$59.4(VDD) U$60.4(VDD) U$61.4(VDD) U$62.4(VDD) U$63.4(VDD) U$64.4(VDD) U$65.4(VDD) U$66.4(VDD) U$67.4(VDD) U$68.4(VDD) U$69.4(VDD) U$70.4(VDD) U$71.4(VDD) U$72.4(VDD) U$73.4(VDD) U$74.4(VDD) U$75.4(VDD) U$76.4(VDD) U$77.4(VDD) U$78.4(VDD) U$79.4(VDD) U$80.4(VDD) U$81.4(VDD) U$82.4(VDD) U$83.4(VDD) U$84.4(VDD) U$85.4(VDD) U$86.4(VDD) U$87.4(VDD) U$88.4(VDD) U$89.4(VDD) U$90.4(VDD) U$91.4(VDD) U$92.4(VDD) U$93.4(VDD) U$94.4(VDD) U$95.4(VDD) U$96.4(VDD) U$97.4(VDD) U$98.4(VDD) U$99.4(VDD) U$100.4(VDD) U$101.4(VDD) U$102.4(VDD) U$103.4(VDD) U$104.4(VDD) U$105.4(VDD) U$106.4(VDD) U$107.4(VDD) U$108.4(VDD) U$109.4(VDD) U$110.4(VDD) U$111.4(VDD) U$112.4(VDD) U$113.4(VDD) U$114.4(VDD) U$115.4(VDD) U$116.4(VDD) U$117.4(VDD) U$118.4(VDD) U$119.4(VDD) U$120.4(VDD) U$121.4(VDD) U$122.4(VDD) U$123.4(VDD) U$124.4(VDD) U$125.4(VDD) U$126.4(VDD) U$127.4(VDD) U$128.4(VDD) U$129.4(VDD) U$130.4(VDD) U$131.4(VDD) U$132.4(VDD) U$133.4(VDD) U$134.4(VDD) U$135.4(VDD) U$136.4(VDD) U$137.4(VDD) U$138.4(VDD) U$139.4(VDD) U$140.4(VDD) U$141.4(VDD) U$142.4(VDD) U$143.4(VDD) U$144.4(VDD) U$145.4(VDD) U$146.4(VDD) U$147.4(VDD) U$148.4(VDD) U$149.4(VDD) U$150.4(VDD) U$151.4(VDD) U$152.4(VDD) U$153.4(VDD) U$154.4(VDD) U$155.4(VDD) U$156.4(VDD) U$157.4(VDD) U$158.4(VDD) U$159.4(VDD) U$160.4(VDD) U$161.4(VDD) U$162.4(VDD) U$163.4(VDD) U$164.4(VDD) U$165.4(VDD) U$166.4(VDD) U$167.4(VDD) U$168.4(VDD) U$169.4(VDD) U$170.4(VDD) U$171.4(VDD) U$172.4(VDD) U$173.4(VDD) U$174.4(VDD) U$175.4(VDD) U$176.4(VDD) U$177.4(VDD) U$178.4(VDD) U$179.4(VDD) U$180.4(VDD) U$181.4(VDD) U$182.4(VDD) U$183.4(VDD) U$184.4(VDD) U$185.4(VDD) U$186.4(VDD) U$187.4(VDD) U$188.4(VDD) U$189.4(VDD) U$190.4(VDD) U$191.4(VDD) U$192.4(VDD) U$193.4(VDD) U$194.4(VDD) U$195.4(VDD) U$196.4(VDD) U$197.4(VDD) U$198.4(VDD) U$199.4(VDD) U$200.4(VDD) U$201.4(VDD) U$202.4(VDD) U$203.4(VDD) U$204.4(VDD) U$205.4(VDD) U$206.4(VDD) U$207.4(VDD) U$208.4(VDD) U$209.4(VDD) U$210.4(VDD) U$211.4(VDD) U$212.4(VDD) U$213.4(VDD) U$214.4(VDD) U$215.4(VDD) U$216.4(VDD) U$217.4(VDD) U$218.4(VDD) U$219.4(VDD) U$220.4(VDD) U$221.4(VDD) U$222.4(VDD) U$223.4(VDD) U$224.4(VDD) U$225.4(VDD) U$226.4(VDD) U$227.4(VDD) U$228.4(VDD) U$229.4(VDD) U$230.4(VDD) U$231.4(VDD) U$232.4(VDD) U$233.4(VDD) U$234.4(VDD) U$235.4(VDD) U$236.4(VDD) U$237.4(VDD) U$238.4(VDD) U$239.4(VDD) U$240.4(VDD) U$241.4(VDD) U$242.4(VDD) U$243.4(VDD) U$244.4(VDD) U$245.4(VDD) U$246.4(VDD) U$247.4(VDD) U$248.4(VDD) U$249.4(VDD) U$250.4(VDD) U$251.4(VDD) U$252.4(VDD) U$253.4(VDD) U$254.4(VDD) U$255.4(VDD) U$256.4(VDD)

## Library data of the parts
J1 = SparkFun-Connectors:CONN_04: Multi connection point. Often used as Generic Header-pin footprint for 0.1 inch spaced/style header connections On any of the 0.1 inch spaced packages, you can populate with these: Break Away Headers - Straight <https://www.sparkfun.com/products/116> (PRT-00116) Break Away Male Headers - Right Angle <https://www.sparkfun.com/products/553> (PRT-00553) Female Headers <https://www.sparkfun.com/products/115> (PRT-00115) Break Away Headers - Machine Pin <https://www.sparkfun.com/products/117> (PRT-00117) Break Away Female Headers - Swiss Machine Pin <https://www.sparkfun.com/products/743> (PRT-00743) For SCREWTERMINALS and SPRING TERMINALS visit here: Screw Terimnals on SparkFun.com <https://www.sparkfun.com/search/results?term=Screw+Terminals> (5mm/3.5mm/2.54mm spacing) This device is also useful as a general connection point to wire up your design to another part of your project. Our various solder wires solder well into these plated through hole pads. Hook-Up Wire - Assortment (Stranded, 22 AWG) <https://www.sparkfun.com/products/11375> (PRT-11375) Hook-Up Wire - Assortment (Solid Core, 22 AWG) <https://www.sparkfun.com/products/11367> (PRT-11367) View the entire wire category on our website here <https://www.sparkfun.com/categories/141> Special notes: Molex polarized connector foot print use with SKU : PRT-08231 with associated crimp pins and housings. 1MM SMD Version SKU: PRT-10208; PROD_ID: CONN-09696
J2 J3 = SparkFun-Connectors:CONN_01: Single connection point. Often used as Generic Header-pin footprint for 0.1 inch spaced/style header connections On any of the 0.1 inch spaced packages, you can populate with these: Break Away Headers - Straight <https://www.sparkfun.com/products/116> (PRT-00116) Break Away Male Headers - Right Angle <https://www.sparkfun.com/products/553> (PRT-00553) Female Headers <https://www.sparkfun.com/products/115> (PRT-00115) Break Away Headers - Machine Pin <https://www.sparkfun.com/products/117> (PRT-00117) Break Away Female Headers - Swiss Machine Pin <https://www.sparkfun.com/products/743> (PRT-00743) This device is also useful as a general connection point to wire up your design to another part of your project. Our various solder wires solder well into these plated through hole pads. Hook-Up Wire - Assortment (Stranded, 22 AWG) <https://www.sparkfun.com/products/11375> (PRT-11375) Hook-Up Wire - Assortment (Solid Core, 22 AWG) <https://www.sparkfun.com/products/11367> (PRT-11367) View the entire wire category on our website here <https://www.sparkfun.com/categories/141> Special notes: SMTSO-256-ET is a "flush mount" nut for a 4-40 screw. We mostly use this on specialty testbeds; it is a nice way to connect hardware to your PCB at an adjustable hieght. Also note, the SNAP packages are for using a snappable style connector. We sell a baggie of snaps and they are also used on two LilyPad designs: Snap Assortment - 30 pack (male and female) <https://www.sparkfun.com/products/11347> (DEV-11347) LilyPad Arduino SimpleSnap <https://www.sparkfun.com/products/10941> (DEV-10941) LilyPad SimpleSnap Protoboard <https://www.sparkfun.com/products/10940> (DEV-10940)
U$1-U$256 = SparkFun-LED:WS2812-2020